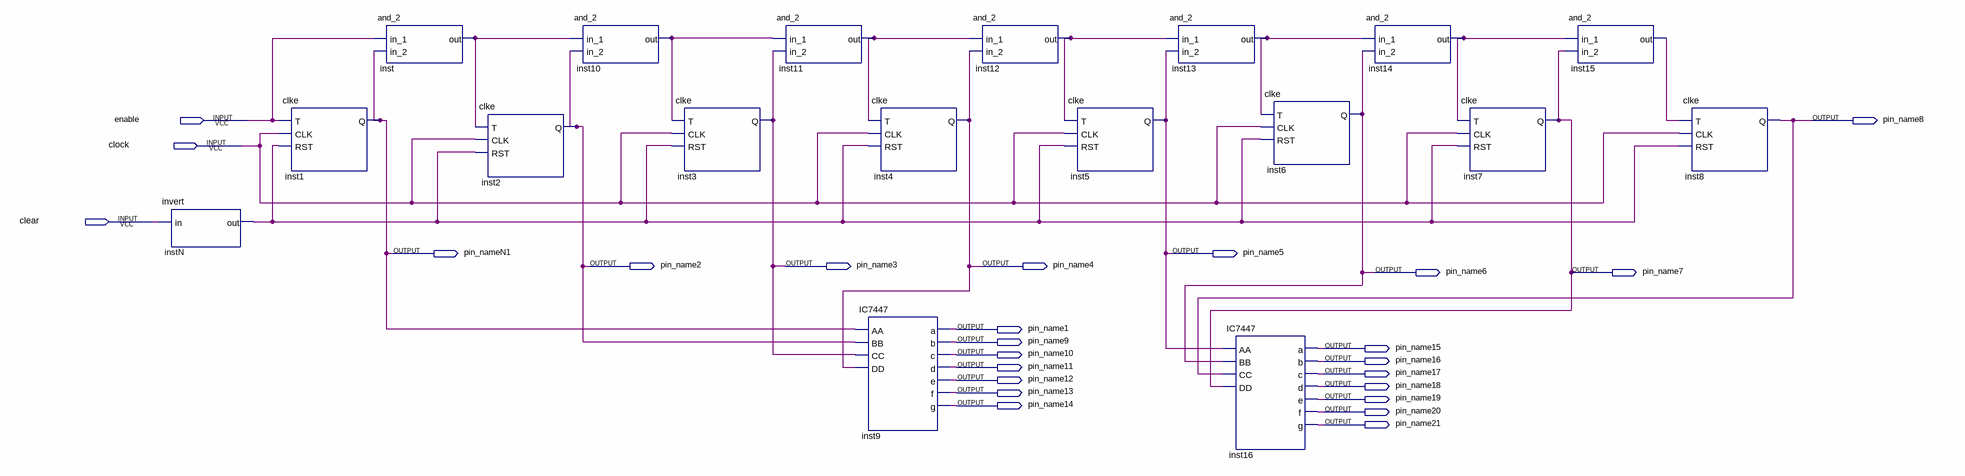
[diagram p0: schematic sheet]
// Quartus schematic Block21.bdf as structural Verilog: 18 symbols, 25 pins
module Block21 (
  input  enable,
  input  clock,
  input  clear,
  output pin_name8,
  output pin_nameN1,
  output pin_name5,
  output pin_name2,
  output pin_name3,
  output pin_name4,
  output pin_name6,
  output pin_name7,
  output pin_name1,
  output pin_name9,
  output pin_name15,
  output pin_name10,
  output pin_name16,
  output pin_name11,
  output pin_name17,
  output pin_name12,
  output pin_name18,
  output pin_name13,
  output pin_name19,
  output pin_name14,
  output pin_name20,
  output pin_name21
);

  wire inst10_out, inst11_out, inst12_out, inst13_out, inst14_out, inst15_out, inst_out, instN_out;

  invert instN (.in(clear), .out(instN_out));
  clke inst1 (.T(enable), .CLK(clock), .RST(instN_out), .Q(pin_nameN1));
  and_2 inst (.in_1(enable), .in_2(pin_nameN1), .out(inst_out));
  clke inst2 (.T(inst_out), .CLK(clock), .RST(instN_out), .Q(pin_name2));
  and_2 inst10 (.in_1(inst_out), .in_2(pin_name2), .out(inst10_out));
  clke inst3 (.T(inst10_out), .CLK(clock), .RST(instN_out), .Q(pin_name3));
  and_2 inst11 (.in_1(inst10_out), .in_2(pin_name3), .out(inst11_out));
  IC7447 inst9 (
    .AA(pin_nameN1), .BB(pin_name2), .CC(pin_name3), .DD(pin_name4), .a(pin_name1), .b(pin_name9),
    .c(pin_name10), .d(pin_name11), .e(pin_name12), .f(pin_name13), .g(pin_name14));
  clke inst4 (.T(inst11_out), .CLK(clock), .RST(instN_out), .Q(pin_name4));
  and_2 inst12 (.in_1(inst11_out), .in_2(pin_name4), .out(inst12_out));
  clke inst5 (.T(inst12_out), .CLK(clock), .RST(instN_out), .Q(pin_name5));
  and_2 inst13 (.in_1(inst12_out), .in_2(pin_name5), .out(inst13_out));
  clke inst6 (.T(inst13_out), .CLK(clock), .RST(instN_out), .Q(pin_name6));
  IC7447 inst16 (
    .AA(pin_name5), .BB(pin_name6), .CC(pin_name8), .DD(pin_name7), .a(pin_name15), .b(pin_name16),
    .c(pin_name17), .d(pin_name18), .e(pin_name19), .f(pin_name20), .g(pin_name21));
  and_2 inst14 (.in_1(inst13_out), .in_2(pin_name6), .out(inst14_out));
  clke inst7 (.T(inst14_out), .CLK(clock), .RST(instN_out), .Q(pin_name7));
  and_2 inst15 (.in_1(inst14_out), .in_2(pin_name7), .out(inst15_out));
  clke inst8 (.T(inst15_out), .CLK(clock), .RST(instN_out), .Q(pin_name8));
endmodule
